# Altium schematic sheet rotboard.SchDoc
size C
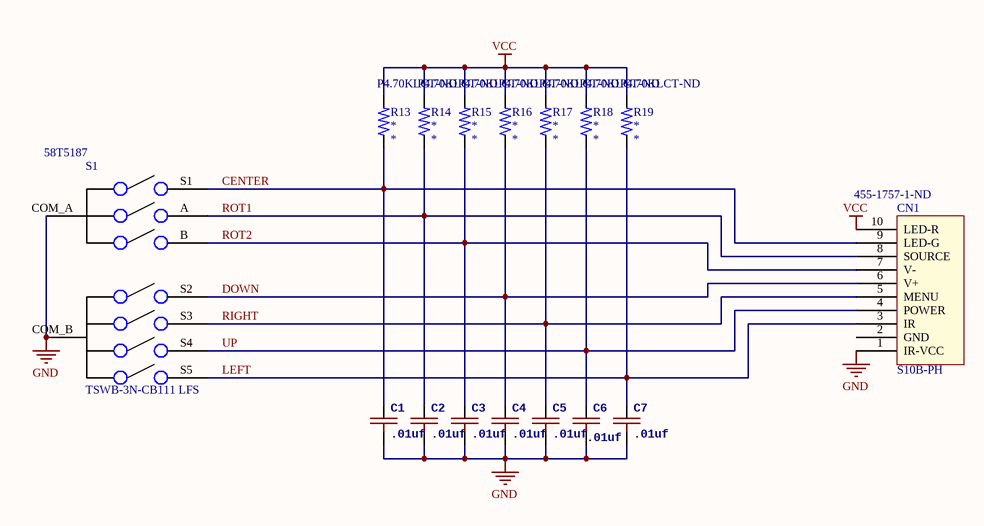
[diagram p0: rotboard.SchDoc]

## Parts
C1  .01uf  [0402C]
C2  .01uf  [0402C]
C3  .01uf  [0402C]
C4  .01uf  [0402C]
C5  .01uf  [0402C]
C6  .01uf  [0402C]
C7  .01uf  [0402C]
CN1  S10B-PH  Supplier Part Number 1: 455-1757-1-ND  [PH-SM4]
R13  *  Supplier Part Number 1: P4.70KLCT-ND  [R0402]
R14  *  Supplier Part Number 1: P4.70KLCT-ND  [R0402]
R15  *  Supplier Part Number 1: P4.70KLCT-ND  [R0402]
R16  *  Supplier Part Number 1: P4.70KLCT-ND  [R0402]
R17  *  Supplier Part Number 1: P4.70KLCT-ND  [R0402]
R18  *  Supplier Part Number 1: P4.70KLCT-ND  [R0402]
R19  *  Supplier Part Number 1: P4.70KLCT-ND  [R0402]
S1  TSWB-3N-CB111 LFS  Supplier Part Number 1: 58T5187  [TSWB-3N-CB111 LFS]

## Nets
GND: C1.2 C2.2 C3.2 C4.2 C5.2 C6.2 C7.2 CN1.1(IR-VCC) S1.COM_A S1.COM_B
VCC: CN1.10(LED-R) R13.2 R14.2 R15.2 R16.2 R17.2 R18.2 R19.2
CENTER: C1.1 CN1.9(LED-G) R13.1 S1.S1
DOWN: C4.1 CN1.6(V+) R16.1 S1.S2
LEFT: C7.1 CN1.3(IR) R19.1 S1.S5
RIGHT: C5.1 CN1.5(MENU) R17.1 S1.S3
ROT1: C2.1 CN1.8(SOURCE) R14.1 S1.A
ROT2: C3.1 CN1.7(V-) R15.1 S1.B
UP: C6.1 CN1.4(POWER) R18.1 S1.S4

Not connected (* = marked no-connect by the designer): CN1 2(GND)

## Library data of the parts
C1-C7 = C-USC0402
R13-R19 = R-US_R0805: Resistor 0805; Value: *; Supplier 1: Digi-Key
CN1 = S10B-PH: Supplier 1: Digi-Key
S1 = TSWB-3N-CB111 LFS: Supplier 1: Newark